# EAGLE design 04B-356 (EAGLE 6.3)
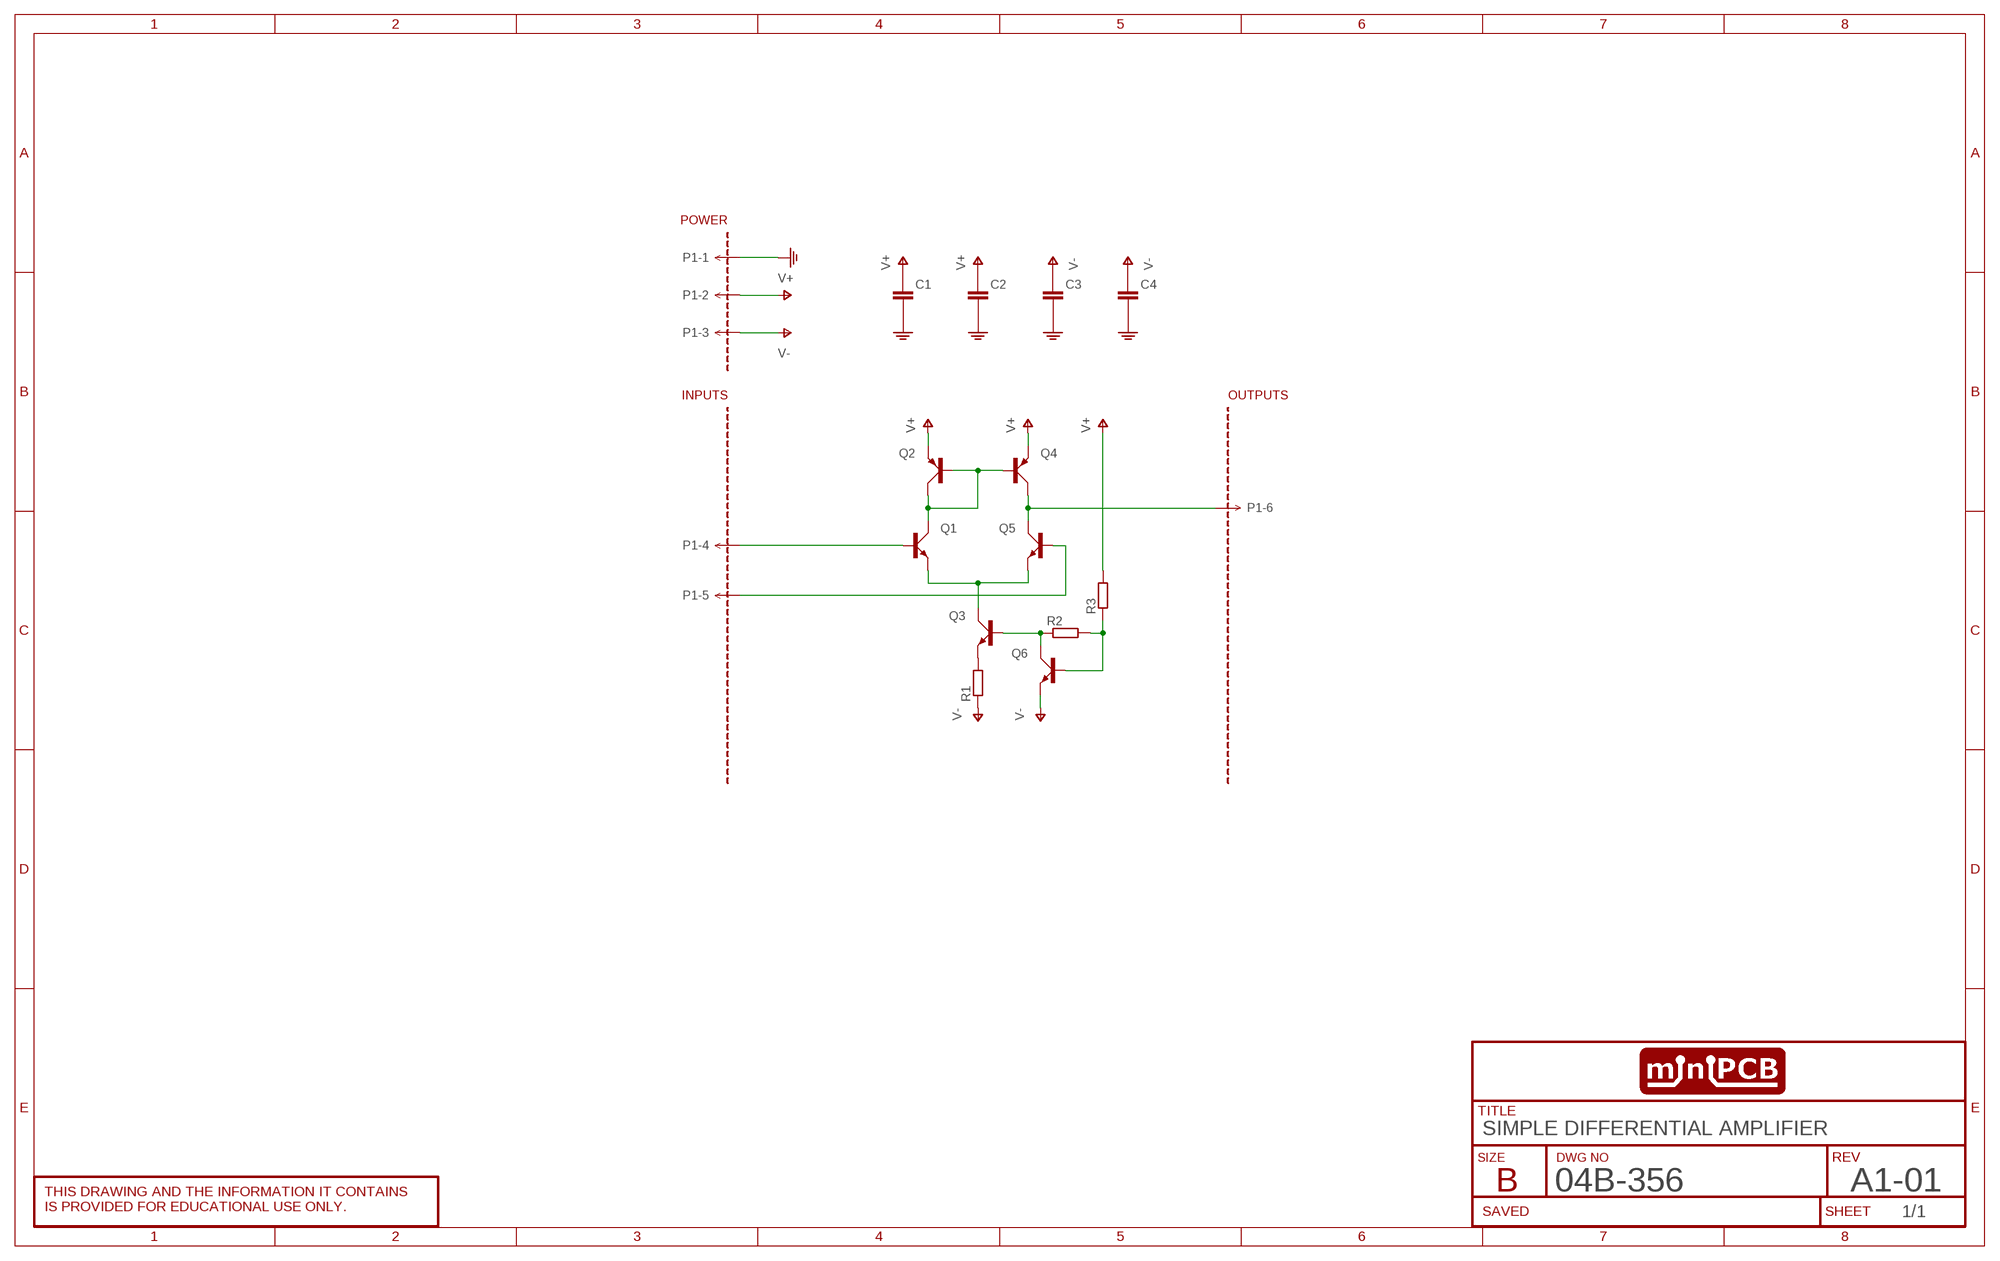
[diagram p0: schematic, sheet 1]
SHEET1 (SCHEMATIC): DWG_NO: 04B-356; REV: A1-01; TITLE: SIMPLE DIFFERENTIAL AMPLIFIER

## Parts
C1  CAPACITORSMD  [C0805]
C2  CAPACITORSMD  [C0805]
C3  CAPACITORSMD  [C0805]
C4  CAPACITORSMD  [C0805]
P1  MINIPCB_6P  [PINS_6]
PCB1  MINIPCB_0PPCB33-20  [PCB33-20]
Q1  BJT_NPNBEC  [SOT23]
Q2  BJT_PNPBEC  [SOT23]
Q3  BJT_NPNBEC  [SOT23]
Q4  BJT_PNPBEC  [SOT23]
Q5  BJT_NPNBEC  [SOT23]
Q6  BJT_NPNBEC  [SOT23]
R1  RESISTORSMD  [R0805]
R2  RESISTORSMD  [R0805]
R3  RESISTORSMD  [R0805]

## Nets
GND: C1.2ASDF(-) C2.2ASDF(-) C3.2ASDF(-) C4.2ASDF(-) P1.1
N$1: Q1.2(E) Q3.3(C) Q5.2(E)
N$2: P1.6 Q4.3(C) Q5.3(C)
N$3: Q1.3(C) Q2.1(B) Q2.3(C) Q4.1(B)
N$5: Q3.1(B) Q6.3(C) R2.1
N$6: Q6.1(B) R2.2 R3.1
N$7: P1.5 Q5.1(B)
N$8: P1.4 Q1.1(B)
N$10: Q3.2(E) R1.2
V+: C1.1ASD(+) C2.1ASD(+) P1.2 Q2.2(E) Q4.2(E) R3.2
V-: C3.1ASD(+) C4.1ASD(+) P1.3 Q6.2(E) R1.1

## Library data of the parts
C1-C4 = minipcb:CAPACITOR
P1 = minipcb:MINIPCB_6P
PCB1 = minipcb:MINIPCB_0P; PART_NUMBER: 04B-356; REVISION: A1-01; TITLE: SIMPLE DIFF. AMP.
Q1 Q3 Q5 Q6 = minipcb:BJT_NPN: TRANSISTOR
Q2 Q4 = minipcb:BJT_PNP: TRANSISTOR
R1-R3 = minipcb:RESISTOR

## Board
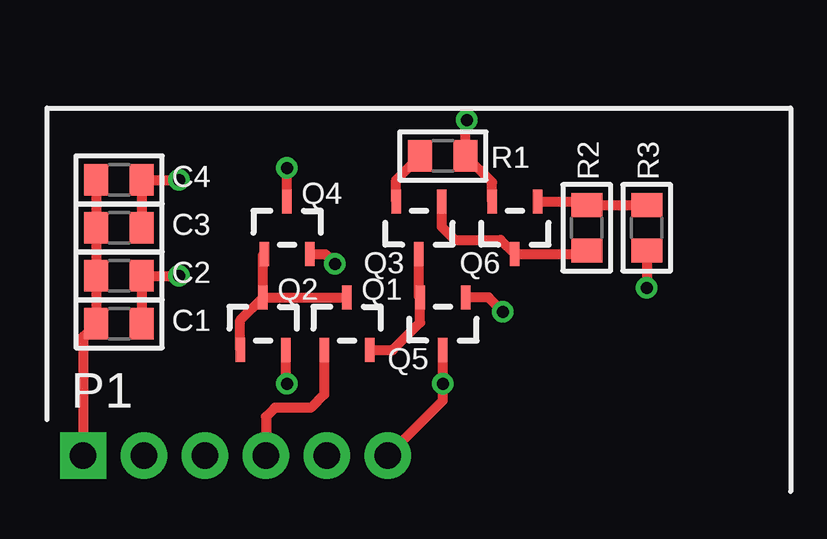
[diagram p1: board, top side]
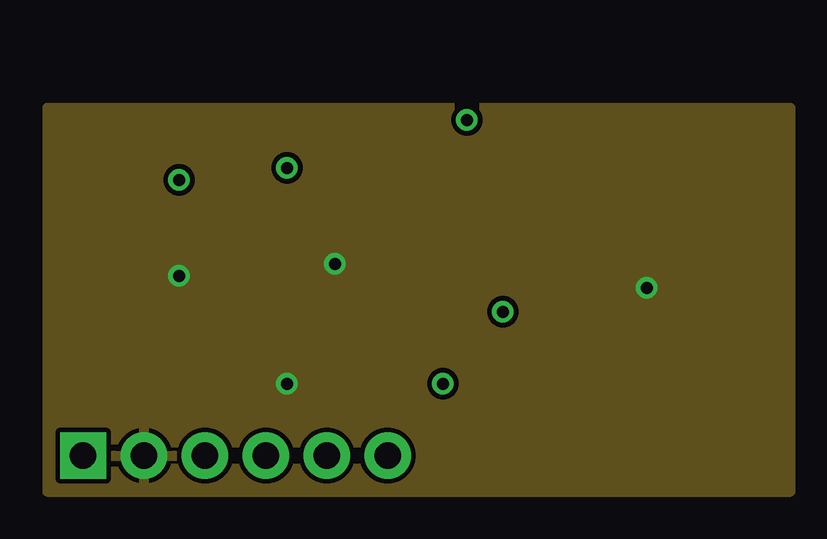
[diagram p2: board, inner layer Route2]
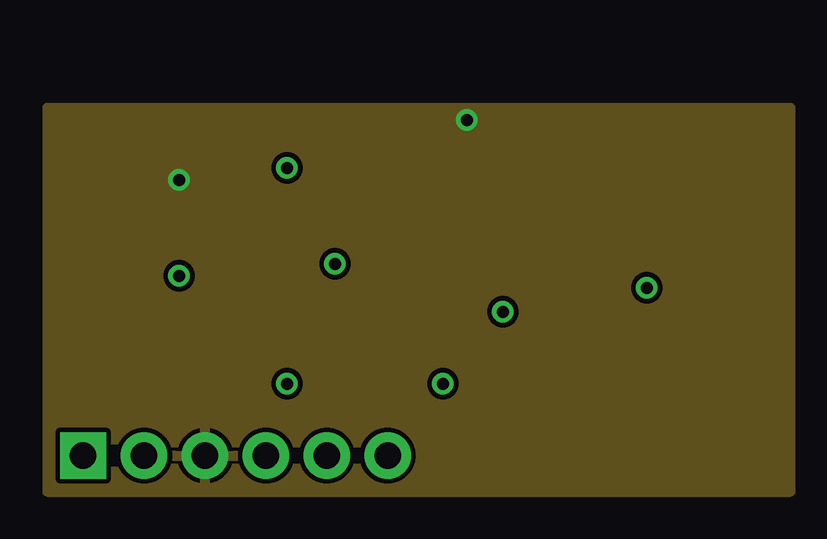
[diagram p3: board, inner layer Route15]
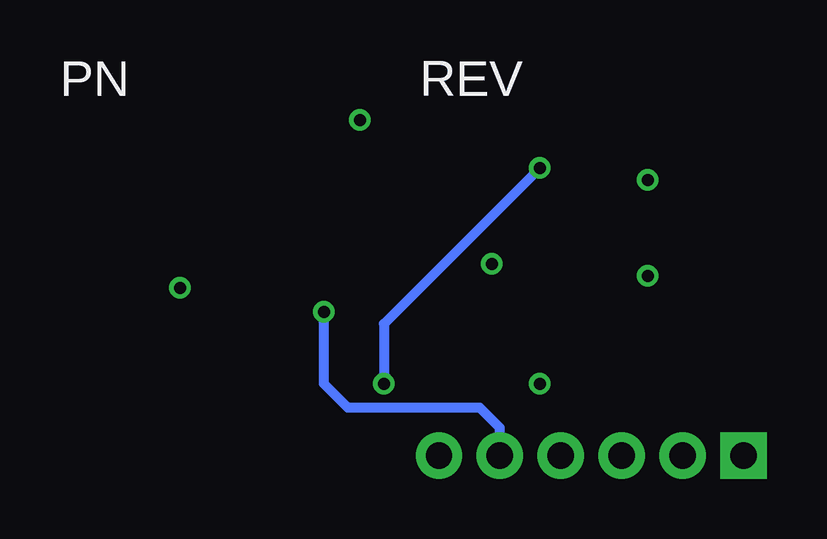
[diagram p4: board, bottom side, seen from below]

No outline drawn. Coordinates in mm, seen from the top.
Copper layers (1+2*15+16): Top 0.035mm / dielectric 0.15mm / Route2 0.035mm / dielectric 0.15mm / Route15 0.035mm / dielectric 0.2mm / Bottom 0.035mm
Design rules "minipcb-SMD-4L": minimum track width 0.25mm, minimum drill 0.5mm, track to track 0.2mm, track to pad 0.2mm, pad to pad 0.15mm, via to via 0.2mm, smd to smd 0.15mm, copper to edge 1mm, drill to drill 1mm, minimum pad ring 0.2mm, minimum via ring 0.2mm, stop-mask expansion 0.1mm, vias tented up to drill 0.55mm, thermal gap 0.2mm

### Footprints (pad centres in the part's own frame; a part is rotated, then mirrored left to right if it is on the bottom)
C0805 = smd 1 x 1.3: 1ASD -0.95,0; 2ASDF 0.95,0
PINS_6 = drill 1.1 pad 1.93 square: 1 0,0 | drill 1.1 pad 1.93: 2 2.54,0; 3 5.08,0; 4 7.62,0; 5 10.16,0; 6 12.7,0
SOT23 = smd 0.4 x 1: 1 -0.95,-1.1; 2 0.95,-1.1; 3 0,1.1
R0805 = smd 1 x 1.3: 1 -0.95,0; 2 0.95,0

### Placement (x,y rotation side)
C1  4,8 180 top
C2  4,10 180 top
C3  4,12 180 top
C4  4,14 180 top
P1  2.5,2.5 0 top
PCB1  0,0 0 top
Q1  13.5,8 0 top
Q2  10,8 0 top
Q3  16.5,12 180 top
Q4  11,12 0 top
Q5  17.5,8 180 top
Q6  20.5,12 180 top
R1  17.5,15 180 top
R2  23.5,12 90 top
R3  26,12 270 top

### Tracks (layer width: path | path; a pad name or v marks a point on that pad's centre or on a via)
GND
  Top 0.406: C4.2ASDF C3.2ASDF C2.2ASDF C1.2ASDF 2.5,7.45 P1.1
N$1
  Top 0.406: Q1.2 15.4,6.9 16.55,8.05 Q5.2 16.5,9.15 Q3.3
N$2  (via drill 0.5)
  Top 0.406: P1.6 17.5,4.8 v17.5,5.5 Q5.3 | Q4.3 v11,14.5
  Bottom 0.406: v11,14.5 17.5,8 v17.5,5.5
N$3
  Top 0.406: Q2.1 9.05,8.15 Q2.3 | Q2.3 10,10.85 Q4.1 | Q2.3 Q1.3
N$5
  Top 0.406: Q3.1 17.45,12.05 18,11.5 19.9,11.5 Q6.3 23.35,10.9 R2.1
N$6
  Top 0.406: Q6.1 23.35,13.1 R2.2 R3.1
N$7  (via drill 0.5)
  Top 0.406: v20,8.5 19.4,9.1 Q5.1
  Bottom 0.406: P1.5 12.66,3.66 13.5,4.5 19,4.5 20,5.5 v20,8.5
N$8
  Top 0.406: Q1.1 12.55,5.05 12,4.5 10.5,4.5 10.12,4.12 P1.4
N$10
  Top 0.406: Q3.2 15.55,14 R1.2
V+  (via drill 0.5)
  Top 0.406: C1.1ASD C2.1ASD v6.5,10 | Q4.2 12.6,10.9 v13,10.5 | Q2.2 10.95,5.55 v11,5.5 | R3.2 v26,9.5
  pour Route2: 1,1 32,1 32,17 1,17
V-  (via drill 0.5)
  Top 0.406: C3.1ASD C4.1ASD v6.5,14 | Q6.2 19.55,13.9 R1.1 18.45,16.45 v18.5,16.5
  pour Route15: 1,1 32,1 32,17 1,17

### Text on the board
_tNames: C4 | R1 | R2 | R3 | Q4 | C3 | Q3 | Q6 | C2 | Q2 | Q1 | C1 | Q5